# EAGLE design motorctrl (EAGLE 9.6.2)
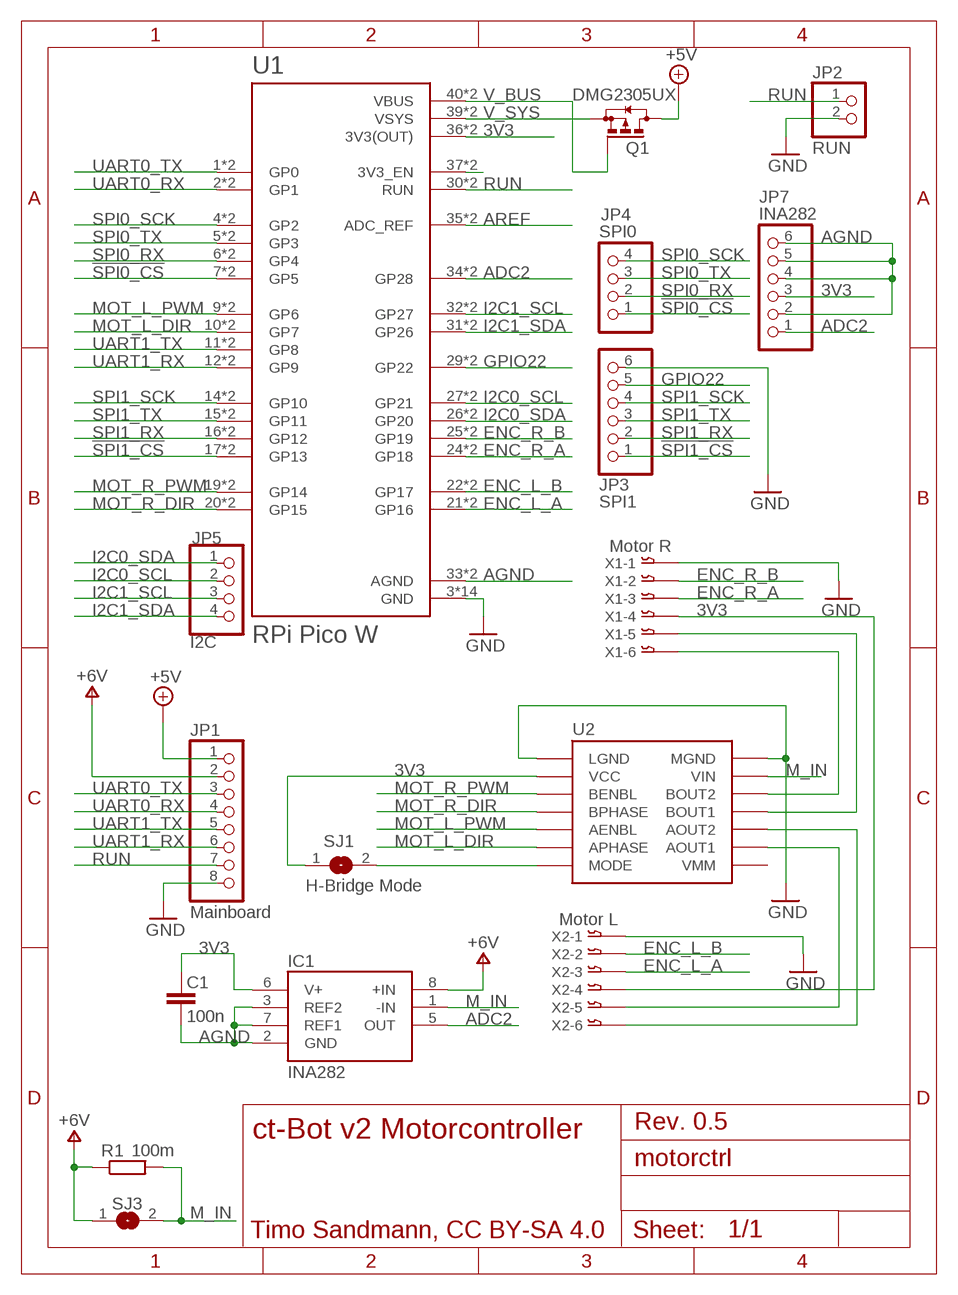
[diagram p0: schematic, sheet 1]

## Parts
C1  100n  C-EUC0805  [C0805]
IC1  INA282  INA28AID  [SO08]
JP1  Mainboard  PINHD-1X8  [1X08]
JP2  RUN  PINHD-1X2  [1X02]
JP3  SPI1  PINHD-1X6  [1X06]
JP4  SPI0  PINHD-1X4  [1X04]
JP5  I2C  PINHD-1X4  [1X04]
JP7  INA282  PINHD-1X6  [1X06]
Q1  DMG2305UX  BSS84  [SOT23]
R1  100m  R-EU_R2512  [R2512]
SJ1  H-Bridge Mode  SJ  [SJ]
SJ3  VREF  SJ  [SJ]
U1  RPi Pico W  RASPBERRY_PICO-NO_DEBUG  [PICO-PKG-NO_DEBUG]
U2  DRV8835THROUGHHOLE  [DRV8835]
X1  Motor R  06-JST-B6B-XH-A  [B6B-XH]
X2  Motor L  06-JST-B6B-XH-A  [B6B-XH]

## Nets
3V3: C1.2 IC1.6(V+) JP7.3 SJ1.1 U1.36(3V3(OUT)) U1.P$36(3V3(OUT)) U2.VCC X1.P$4 X2.P$4
3V3_EN: U1.37(3V3_EN) U1.P$37(3V3_EN)
!SPI0_CS: JP4.1 U1.7(GP5) U1.P$7(GP5)
!SPI1_CS: JP3.1 U1.17(GP13) U1.P$17(GP13)
+5V: JP1.1 Q1.3(D)
+6V: IC1.8(+IN) JP1.2 R1.1 SJ3.1
ADC2: IC1.5(OUT) JP7.1 U1.34(GP28) U1.P$34(GP28)
AGND: C1.1 IC1.2(GND) IC1.3(REF2) IC1.7(REF1) JP7.2 JP7.4 JP7.5 JP7.6 U1.33(AGND) U1.P$33(AGND)
AREF: U1.35(ADC_REF) U1.P$35(ADC_REF)
ENC_L_A: U1.21(GP16) U1.P$21(GP16) X2.P$3
ENC_L_B: U1.22(GP17) U1.P$22(GP17) X2.P$2
ENC_R_A: U1.24(GP18) U1.P$24(GP18) X1.P$3
ENC_R_B: U1.25(GP19) U1.P$25(GP19) X1.P$2
GND: JP1.8 JP2.2 JP3.6 U1.3(GND) U1.8(GND) U1.13(GND) U1.18(GND) U1.23(GND) U1.28(GND) U1.38(GND) U1.P$3(GND) U1.P$8(GND) U1.P$13(GND) U1.P$18(GND) U1.P$23(GND) U1.P$28(GND) U1.P$38(GND) U2.LGND U2.MGND X1.P$1 X2.P$1
GPIO22: JP3.5 U1.29(GP22) U1.P$29(GP22)
I2C0_SCL: JP5.2 U1.27(GP21) U1.P$27(GP21)
I2C0_SDA: JP5.1 U1.26(GP20) U1.P$26(GP20)
I2C1_SCL: JP5.3 U1.32(GP27) U1.P$32(GP27)
I2C1_SDA: JP5.4 U1.31(GP26) U1.P$31(GP26)
M_IN: IC1.1(-IN) R1.2 SJ3.2 U2.VIN
MOT_L_DIR: U1.10(GP7) U1.P$10(GP7) U2.APHASE
MOT_L_PWM: U1.9(GP6) U1.P$9(GP6) U2.AENBL
MOT_R_DIR: U1.20(GP15) U1.P$20(GP15) U2.BPHASE
MOT_R_PWM: U1.19(GP14) U1.P$19(GP14) U2.BENBL
N$3: SJ1.2 U2.MODE
N$4: U2.BOUT1 X1.P$5
N$5: U2.BOUT2 X1.P$6
N$6: U2.AOUT1 X2.P$5
N$7: U2.AOUT2 X2.P$6
RUN: JP1.7 JP2.1 U1.30(RUN) U1.P$30(RUN)
SPI0_RX: JP4.2 U1.6(GP4) U1.P$6(GP4)
SPI0_SCK: JP4.4 U1.4(GP2) U1.P$4(GP2)
SPI0_TX: JP4.3 U1.5(GP3) U1.P$5(GP3)
SPI1_RX: JP3.2 U1.16(GP12) U1.P$16(GP12)
SPI1_SCK: JP3.4 U1.14(GP10) U1.P$14(GP10)
SPI1_TX: JP3.3 U1.15(GP11) U1.P$15(GP11)
UART0_RX: JP1.4 U1.2(GP1) U1.P$2(GP1)
UART0_TX: JP1.3 U1.1(GP0) U1.P$1(GP0)
UART1_RX: JP1.6 U1.12(GP9) U1.P$12(GP9)
UART1_TX: JP1.5 U1.11(GP8) U1.P$11(GP8)
V_BUS: Q1.1(G) U1.40(VBUS) U1.P$40(VBUS)
V_SYS: Q1.2(S) U1.39(VSYS) U1.P$39(VSYS)
Unconnected: U2.VMM

## Notes on the sheet
- Rev. 0.5
- ct-Bot v2 Motorcontroller
- Timo Sandmann, CC BY-SA 4.0

## Library data of the parts
C1 = rcl:C-EU: CAPACITOR, European symbol; SPICEPREFIX: C
IC1 = ct-bot:INA28*: High-Accuracy, Wide Common-Mode Range, Bidirectional Current Shunt Monitors, Zero-Drift Series; MF: TEXAS INSTRUMENTS
JP1 = ct-bot:PINHD-1X8: PIN HEADER
JP2 = ct-bot:PINHD-1X2: PIN HEADER
JP3 JP7 = ct-bot:PINHD-1X6: PIN HEADER
JP4 JP5 = ct-bot:PINHD-1X4: PIN HEADER
Q1 = transistor-small-signal:BSS84: P-CHANNEL MOS FET
R1 = rcl:R-EU_: RESISTOR, European symbol; SPICEPREFIX: R
SJ1 SJ3 = jumper:SJ: SMD solder JUMPER
U1 = rpi_pico:RASPBERRY_PICO-NO_DEBUG
U2 = ct-bot:DRV8835
X1 X2 = ct-bot:06-JST: JST CONNECTOR

## Board
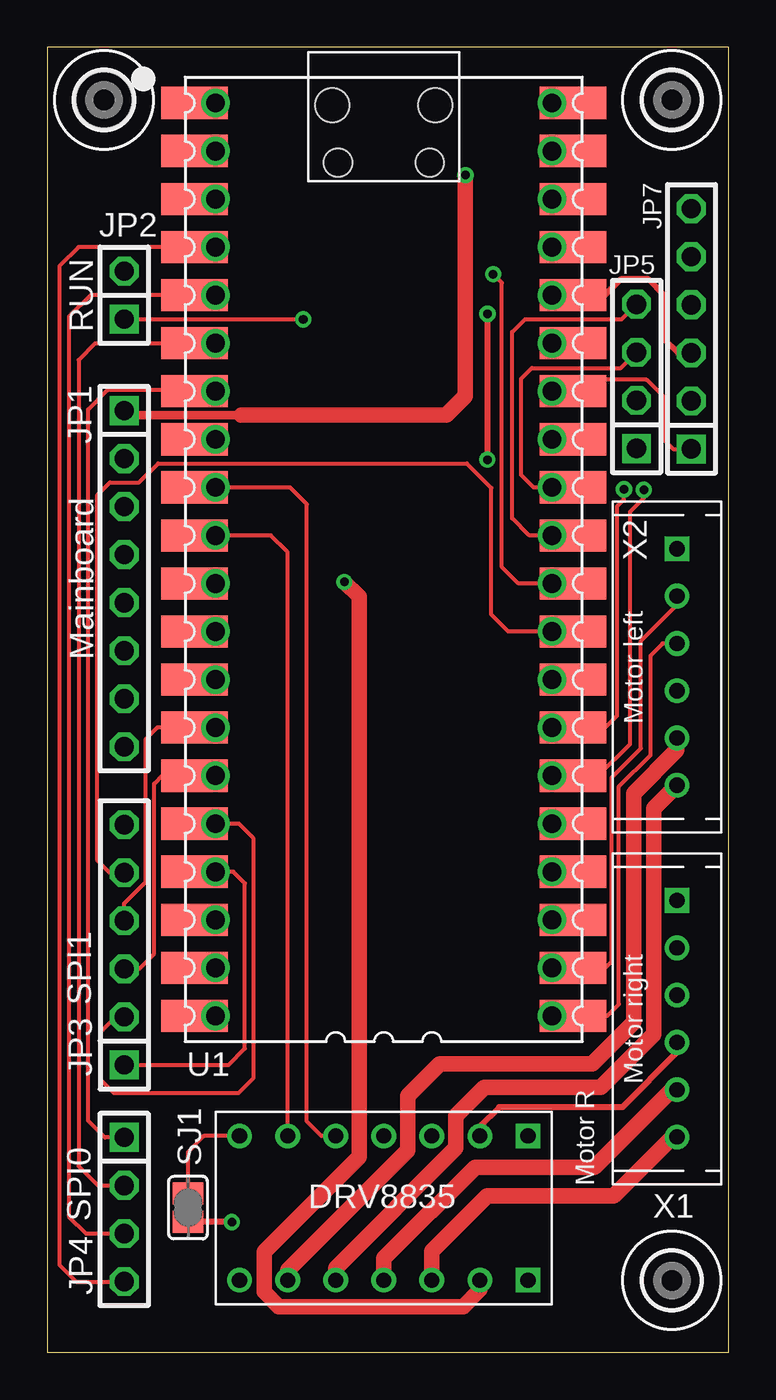
[diagram p1: board, top side]
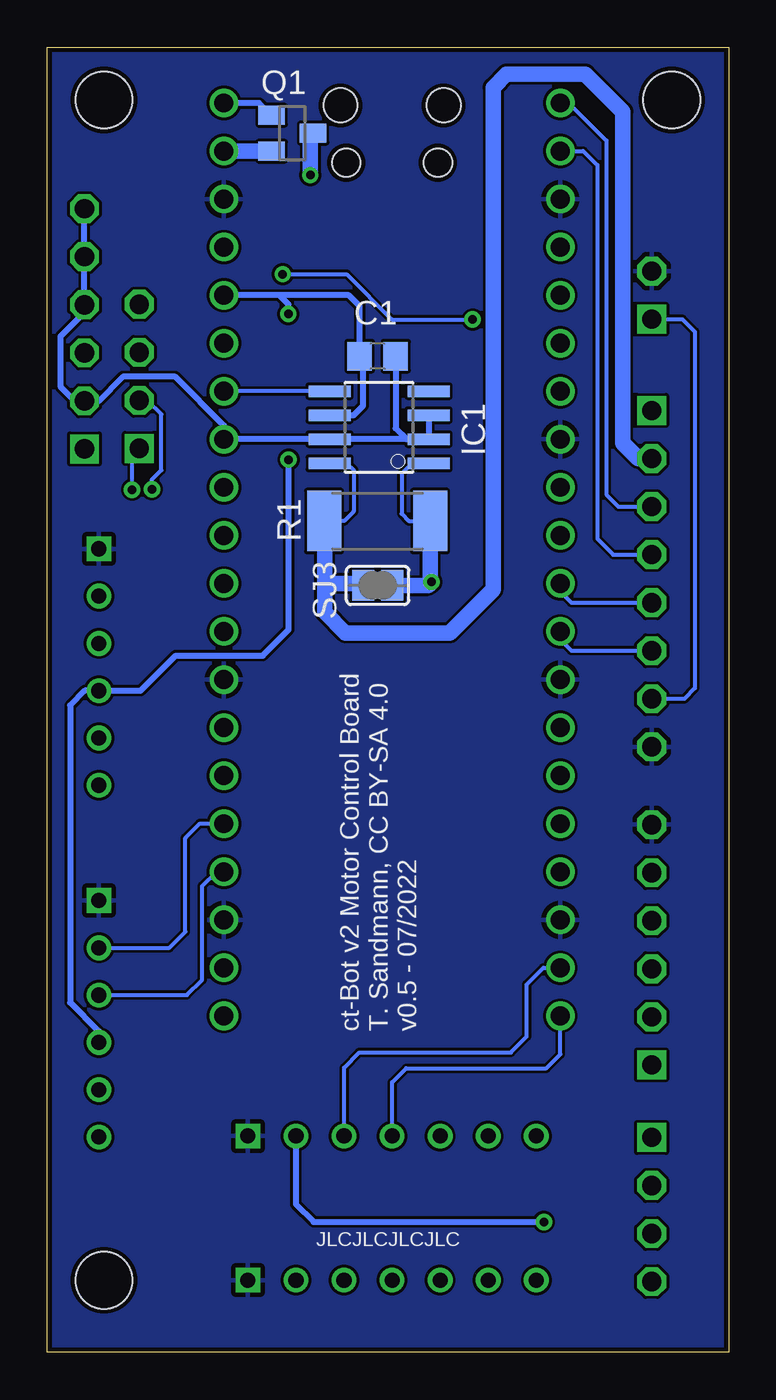
[diagram p2: board, bottom side, seen from below]

Size 36 x 68.98 mm. Coordinates in mm from the lower left corner, seen from the top.
Outline: 0,0 36,0 36,68.98 0,68.98 0,0
Copper layers (1*16): Top 0.035mm / dielectric 1.5mm / Bottom 0.035mm
Design rules "jlcpcb_2layer_DRU": minimum track width 6mil, minimum drill 0.3mm, track to track 6mil, track to pad 6mil, pad to pad 6mil, via to via 6mil, smd to smd 6mil, copper to edge 10mil, drill to drill 6mil, minimum pad ring 10mil, minimum via ring 8mil, stop-mask expansion 4mil, vias tented up to drill 0mil, thermal gap 10mil

### Footprints (pad centres in the part's own frame; a part is rotated, then mirrored left to right if it is on the bottom)
C0805 = smd 1.3 x 1.5: 1 -0.95,0; 2 0.95,0
3,0 = hole 3: 0,0
SO08 = smd 0.61 x 2.21: 1 -1.905,-2.616; 2 -0.635,-2.616; 3 0.635,-2.616; 4 1.905,-2.616; 5 1.905,2.616; 6 0.635,2.616; 7 -0.635,2.616; 8 -1.905,2.616
1X08 = drill 1.016 square: 1 -8.89,0 | drill 1.016 octagon: 2 -6.35,0; 3 -3.81,0; 4 -1.27,0; 5 1.27,0; 6 3.81,0; 7 6.35,0; 8 8.89,0
1X02 = drill 1.016 square: 1 -1.27,0 | drill 1.016 octagon: 2 1.27,0
1X06 = drill 1.016 square: 1 -6.35,0 | drill 1.016 octagon: 2 -3.81,0; 3 -1.27,0; 4 1.27,0; 5 3.81,0; 6 6.35,0
1X04 = drill 1.016 square: 1 -3.81,0 | drill 1.016 octagon: 2 -1.27,0; 3 1.27,0; 4 3.81,0
SOT23 = smd 1 x 1.4: 1 -0.95,-1.1; 2 0.95,-1.1; 3 0,1.1
R2512 = smd 1.8 x 3.2: 1 -2.8,0; 2 2.8,0
SJ = smd 1.168 x 1.6: 1 -0.762,0; 2 0.762,0
PICO-PKG-NO_DEBUG = drill 1: 1 -7.62,25.4; 2 -7.62,22.86; 3 -7.62,20.32; 4 -7.62,17.78; 5 -7.62,15.24; 6 -7.62,12.7; 7 -7.62,10.16; 8 -7.62,7.62; 9 -7.62,5.08; 10 -7.62,2.54; 11 -7.62,0; 12 -7.62,-2.54; 13 -7.62,-5.08; 14 -7.62,-7.62; 15 -7.62,-10.16; 16 -7.62,-12.7; 17 -7.62,-15.24; 18 -7.62,-17.78; 19 -7.62,-20.32; 20 -7.62,-22.86; 21 10.16,-22.86; 22 10.16,-20.32; 23 10.16,-17.78; 24 10.16,-15.24; 25 10.16,-12.7; 26 10.16,-10.16; 27 10.16,-7.62; 28 10.16,-5.08; 29 10.16,-2.54; 30 10.16,0; 31 10.16,2.54; 32 10.16,5.08; 33 10.16,7.62; 34 10.16,10.16; 35 10.16,12.7; 36 10.16,15.24; 37 10.16,17.78; 38 10.16,20.32; 39 10.16,22.86; 40 10.16,25.4 | smd 3.5 x 1.7: P$1 -8.73,25.4; P$2 -8.73,22.86; P$3 -8.73,20.32; P$4 -8.73,17.78; P$5 -8.73,15.24; P$6 -8.73,12.7; P$7 -8.73,10.16; P$8 -8.73,7.62; P$9 -8.73,5.08; P$10 -8.73,2.54; P$11 -8.73,0; P$12 -8.73,-2.54; P$13 -8.73,-5.08; P$14 -8.73,-7.62; P$15 -8.73,-10.16; P$16 -8.73,-12.7; P$17 -8.73,-15.24; P$18 -8.73,-17.78; P$19 -8.73,-20.32; P$20 -8.73,-22.86; P$21 11.27,-22.86; P$22 11.27,-20.32; P$23 11.27,-17.78; P$24 11.27,-15.24; P$25 11.27,-12.7; P$26 11.27,-10.16; P$27 11.27,-7.62; P$28 11.27,-5.08; P$29 11.27,-2.54; P$30 11.27,0; P$31 11.27,2.54; P$32 11.27,5.08; P$33 11.27,7.62; P$34 11.27,10.16; P$35 11.27,12.7; P$36 11.27,15.24; P$37 11.27,17.78; P$38 11.27,20.32; P$39 11.27,22.86; P$40 11.27,25.4 | hole 1.8: -1.455,25.27; 3.995,25.27 | hole 1.5: -1.155,22.24; 3.695,22.24
DRV8835 = drill 0.8: AENBL 1.27,6.35; AOUT1 8.89,3.81; AOUT2 8.89,6.35; APHASE 1.27,3.81; BENBL 1.27,11.43; BOUT1 8.89,8.89; BOUT2 8.89,11.43; BPHASE 1.27,8.89; MODE 1.27,1.27; VCC 1.27,13.97; VIN 8.89,13.97; VMM 8.89,1.27 | drill 0.8 square: LGND 1.27,16.51; MGND 8.89,16.51
B6B-XH = drill 0.8 square: P$1 6.25,0 | drill 0.8: P$2 3.75,0; P$3 1.25,0; P$4 -1.25,0; P$5 -3.75,0; P$6 -6.25,0

### Placement (x,y rotation side)
C1  18.54,52.65 180 bottom
H1  MOUNT-HOLE3.0  [3,0]  33,3.8 0 top
H2  MOUNT-HOLE3.0  [3,0]  33,66.2 0 top
H3  MOUNT-HOLE3.0  [3,0]  3,66.2 0 top
IC1  18.47,48.9 90 bottom
JP1  4.06,40.89 270 top
JP2  4.06,55.88 90 top
JP3  4.06,21.54 90 top
JP4  4.06,7.54 270 top
JP5  31.14,51.59 90 top
JP7  34.04,54.1 90 top
Q1  23.05,64.44 270 bottom
R1  18.57,43.94 0 bottom
SJ1  7.44,7.65 90 top
SJ3  18.54,40.54 0 bottom
U1  16.51,40.64 0 top
U2  8.89,12.7 270 top
X1  33.27,17.63 90 top
X2  33.27,36.22 90 top

### Tracks (layer width: path | path; a pad name or v marks a point on that pad's centre or on a via)
3V3  (via drill 0.45)
  Top 0.203: U1.P$36 U1.36
  Top 0.305: U1.P$36 29.46,55.88 30.3,56.72 31.77,56.72 32.56,55.93 32.56,53.59 33.33,52.83 JP7.3 | X1.P$4 33.27,15.84 30.38,12.95 23.88,12.95 22.86,11.94 U2.VCC | v9.75,6.88 SJ1.1 | v23.27,54.89 23.25,54.87 v23.25,47.19
  Bottom 0.305: IC1.6 19.81,49.53 19.3,50.04 19.3,52.47 C1.2 19.49,55.31 20.07,55.88 23.75,55.88 | 23.75,55.88 U1.36 | v23.25,47.19 23.25,38.19 24.61,36.83 29.21,36.83 31.07,34.97 X2.P$4 34.02,34.97 34.8,34.19 34.8,18.49 33.27,16.97 X1.P$4 | U2.VCC 22.86,7.82 21.92,6.88 v9.75,6.88 | v23.27,54.89 23.27,55.4 23.75,55.88
3V3_EN
  Top 0.203: U1.P$37 U1.37
!SPI0_CS
  Top 0.203: JP4.1 3.05,11.35 2.16,12.24 2.16,49.84 3.17,50.85 7.83,50.85 | U1.7 8.84,50.85 7.83,50.85 | U1.P$7 7.83,50.85
!SPI1_CS
  Top 0.203: JP3.1 9.58,15.19 10.44,16.05 10.44,24.79 9.83,25.4 U1.17 U1.P$17
+5V  (via drill 0.45)
  Top 0.457: JP1.1 4.32,49.53 10.26,49.53
  Top 0.813: 10.26,49.53 21.08,49.53 22.1,50.55 v22.1,62.23
  Bottom 0.813: Q1.3 22.11,64.29 v22.11,62.24 v22.1,62.23
+6V
  Bottom 0.203: IC1.8 20.17,46.99 19.81,46.63 19.81,44.45 20.32,43.94 21.34,43.94 R1.1
  Bottom 0.813: JP1.2 4.78,47.24 5.59,48.06 5.59,65.58 7.57,67.56 11.73,67.56 12.45,66.85 12.45,40.31 14.73,38.02 20.24,38.02 21.34,39.12 21.34,40.64 | 21.34,40.64 21.34,43.94 | SJ3.1 19.41,40.64 21.34,40.64
ADC2
  Top 0.203: U1.34 U1.P$34 28.39,51.41 31.67,51.41 32.51,50.57 32.51,48.31 33.07,47.75 JP7.1
  Bottom 0.203: IC1.5 U1.34
AGND
  Top 0.203: U1.P$33 U1.33
  Bottom 0.305: JP7.6 JP7.5 JP7.4 34.04,54.97 35.31,53.7 35.31,51.05 34.54,50.29 JP7.2 33.27,50.29 32,51.56 29.23,51.56 26.67,49 U1.33 IC1.7 17.02,48.26 | 17.02,48.26 IC1.2 IC1.3 | C1.1 17.59,48.83 17.02,48.26
AREF
  Top 0.203: U1.P$35 U1.35
ENC_L_A
  Top 0.203: U1.21 26.92,17.78 U1.P$21 29.59,17.78 30.2,18.39 30.2,29.9 31.88,31.57 31.88,36.83 32.52,37.47 X2.P$3
ENC_L_B
  Top 0.203: X2.P$2 33.27,39.5 31.37,37.59 31.37,31.93 29.82,30.38 29.82,20.65 29.49,20.32 U1.22 U1.P$22
ENC_R_A
  Top 0.203: U1.P$24 U1.24
  Bottom 0.203: U1.24 27.05,25.4 27.81,24.64 27.81,19.68 28.62,18.88 X1.P$3
ENC_R_B
  Top 0.203: U1.P$25 U1.25
  Bottom 0.203: X1.P$2 29.55,21.38 28.7,22.23 28.7,27.18 27.94,27.94 U1.25
GND
  Top 0.203: U1.P$38 U1.38 | U1.P$28 U1.28 | U1.P$23 U1.23 | U1.P$18 U1.18 | U1.P$13 U1.13 | U1.P$8 U1.8 | U1.P$3 U1.3
  pour Bottom: -1.27,71.12 36.83,71.12 36.83,-1.27 -1.27,-1.27
GPIO22
  Top 0.203: JP3.5 3.3,25.35 2.64,26.01 2.64,45.31 3.3,45.97 4.84,45.97 5.86,46.99 22.17,46.99 23.47,45.7 23.47,38.99 24.36,38.1 U1.29 U1.P$29
I2C0_SCL  (via drill 0.45)
  Top 0.203: U1.27 U1.P$27 29.47,33.02 30.11,33.66 30.11,44.72 30.47,45.09 v30.47,45.62
  Bottom 0.203: v30.47,45.62 30.47,46.13 29.97,46.62 29.97,49.58 30.71,50.32 JP5.2
I2C0_SDA  (via drill 0.45)
  Top 0.203: U1.P$26 U1.26 29.12,30.48 30.79,32.15 30.79,44.43 31.52,45.16 v31.52,45.59
  Bottom 0.203: v31.52,45.59 31.52,47.4 JP5.1
I2C1_SCL
  Top 0.203: U1.32 U1.P$32 25.7,45.72 25.04,46.38 25.04,51.46 25.61,52.03 30.31,52.03 JP5.3
I2C1_SDA
  Top 0.203: U1.P$31 U1.31 25.48,43.18 24.57,44.09 24.57,53.93 25.25,54.61 30.35,54.61 JP5.4
M_IN  (via drill 0.45)
  Top 0.813: U2.VIN 22.86,3.3 21.97,2.41 12.24,2.41 11.46,3.2 11.46,5.31 16.47,10.33 16.47,39.94 v15.7,40.72
  Bottom 0.203: IC1.1 16.74,46.99 17.27,46.46 17.27,44.32 16.89,43.94 R1.2
  Bottom 0.813: v15.7,40.72 15.88,40.54 | 15.88,40.54 15.87,40.54 15.77,40.64 R1.2 | SJ3.2 15.88,40.54
MOT_L_DIR
  Top 0.203: U2.APHASE 12.7,42.29 11.81,43.18 U1.10 U1.P$10
MOT_L_PWM
  Top 0.203: U2.AENBL 14.48,11.43 13.72,12.19 13.72,44.83 12.83,45.72 U1.9 U1.P$9
MOT_R_DIR
  Top 0.203: U1.P$20 U1.20
  Bottom 0.203: U2.BPHASE 17.78,14.28 17.04,15.01 9.63,15.01 8.89,15.75 U1.20
MOT_R_PWM
  Top 0.203: U1.P$19 U1.19
  Bottom 0.203: U2.BENBL 20.32,15.04 19.51,15.85 11.51,15.85 10.67,16.69 10.67,19.43 9.78,20.32 U1.19
N$3
  Top 0.203: U2.MODE 8.28,11.43 7.44,10.59 SJ1.2
N$4
  Top 0.813: U2.BOUT1 17.78,4.95 22.61,9.78 28.91,9.78 33,13.88 X1.P$5
N$5
  Top 0.813: U2.BOUT2 20.32,5.33 23.24,8.26 29.92,8.26 33.04,11.38 X1.P$6
N$6
  Top 0.813: U2.AOUT1 12.7,4.32 19.05,10.67 19.05,13.56 20.73,15.24 28.8,15.24 30.99,17.42 30.99,29.54 33.27,31.83 X2.P$5
N$7
  Top 0.813: U2.AOUT2 15.24,4.45 21.59,10.79 21.59,12.5 23.09,13.99 29.23,13.99 32.05,16.82 32.05,28.75 X2.P$6
RUN  (via drill 0.45, 0.45 pad 0.6)
  Top 0.203: JP2.1 4.08,54.6 v13.53,54.6 | U1.30 U1.P$30 24.89,40.64 24.03,41.5 24.03,56.54 23.57,57 v23.56,56.98
  Bottom 0.203: v23.56,56.98 20.18,56.98 17.79,54.6 v13.53,54.6 | JP2.1 2.44,54.61 1.78,53.95 1.78,35.1 2.34,34.54 JP1.7
SPI0_RX
  Top 0.203: JP4.2 2.67,8.81 1.65,9.83 1.65,52.45 2.54,53.34 U1.6 U1.P$6
SPI0_SCK
  Top 0.203: JP4.4 1.52,3.73 0.64,4.62 0.64,57.4 1.65,58.42 U1.4 U1.P$4
SPI0_TX
  Top 0.203: JP4.3 2.03,6.27 1.14,7.16 1.14,54.74 2.29,55.88 U1.5 U1.P$5
SPI1_RX
  Top 0.203: JP3.2 3.61,17.73 2.79,16.92 2.79,14.43 3.53,13.69 10.08,13.69 10.9,14.5 10.9,27.15 10.11,27.94 U1.16 U1.P$16
SPI1_SCK
  Top 0.203: 7.8,33.05 5.84,33.05 5.21,32.41 5.21,24.87 4.06,23.72 JP3.4 | U1.14 8.87,33.05 8.64,33.05 7.8,33.05 | U1.P$14 7.8,33.05
SPI1_TX
  Top 0.203: JP3.3 4.85,20.27 5.64,21.06 5.64,30.05 6.07,30.48 U1.P$15 8.64,30.48 U1.15
UART0_RX
  Top 0.203: U1.P$2 U1.2
  Bottom 0.203: U1.2 7.68,63.5 6.93,62.75 6.93,43 6.1,42.16 JP1.4
UART0_TX
  Top 0.203: U1.P$1 U1.1
  Bottom 0.203: U1.1 8.44,66.04 6.45,64.05 6.45,45.34 5.82,44.7 JP1.3
UART1_RX
  Top 0.203: U1.P$12 U1.12
  Bottom 0.203: U1.12 8.89,37.67 8.31,37.08 JP1.6
UART1_TX
  Top 0.203: U1.P$11 U1.11
  Bottom 0.203: U1.11 8.89,40.21 8.31,39.62 JP1.5
V_BUS
  Top 0.203: U1.P$40 U1.40
  Bottom 0.305: Q1.1 24.8,66.04 U1.40
V_SYS
  Top 0.203: U1.P$39 U1.39
  Bottom 0.813: Q1.2 U1.39

### Text on the board
tPlace: RUN | Mainboard | Motor left | SPI1 | Motor right | Motor R | SPI0
bPlace: ct-Bot v2 Motor Control Board / T. Sandmann, CC BY-SA 4.0 / v0.5 - 07/2022 | JLCJLCJLCJLC